# Altium schematic sheet PumpSystem.SchDoc
size A3; CompanyName: FEDEVEL; Organization: FEDEVEL; DocumentNumber: 3; Revision: V1I1; SheetNumber: 3; SheetTotal: 12; PageSetup: Record=PageOptions|CenterHorizontal=True|CenterVertical=True|PrintScale=1.07|XCorrection=1.00|YCorrection=1.00|PrintKind=1|BorderSize=5000000|LeftOffset=0|BottomOffset=0|Orientation=2|PaperLength=1000|PaperWidth=1000|Scale=100|PaperSource=7|PrintQuality=600|MediaType=1|DitherType=10|PaperKind=A3|PrintScaleMode=1; ProjectName: KDS C6A816x Module
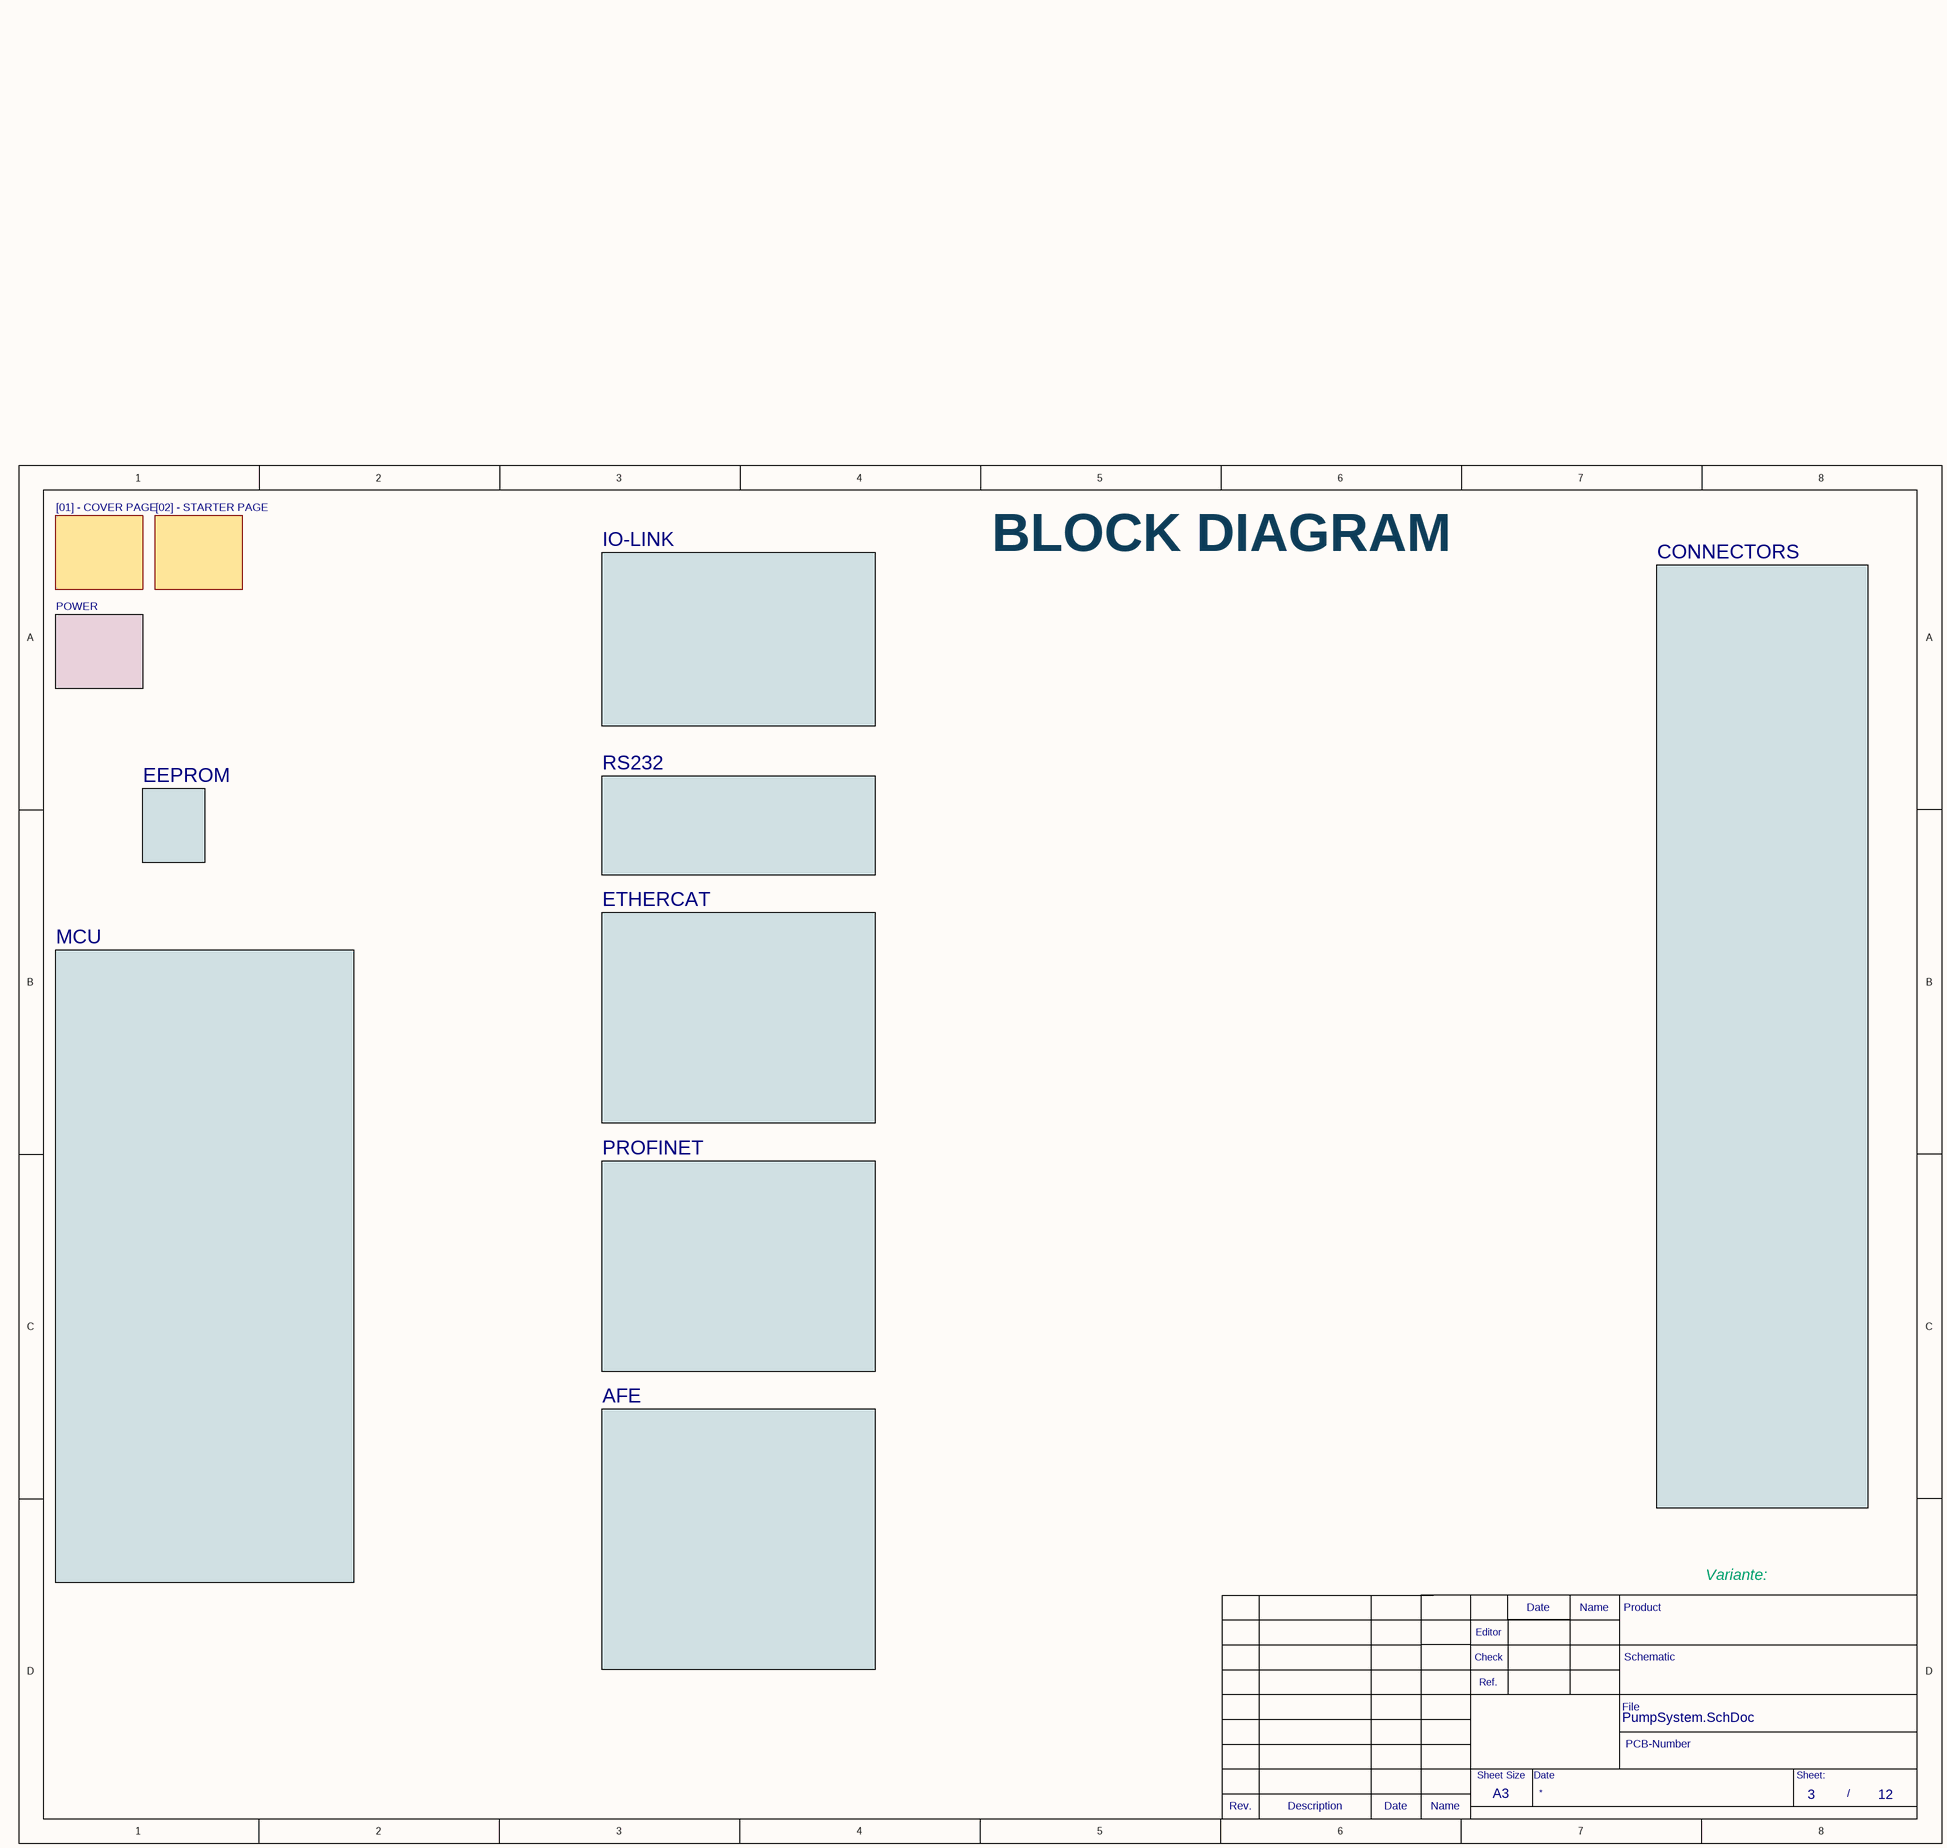
[diagram p0: PumpSystem.SchDoc]

## Sub-sheets
[01] - COVER PAGE = [01] - COVER PAGE.SchDoc: no entries
[02] - STARTER PAGE = [02] - STARTER PAGE.SchDoc: no entries
AFE = [09] - AFE.SchDoc: no entries
CONNECTORS = [10] - CONNECTORs.SchDoc: no entries
EEPROM = [11] - EEPROM.SchDoc: no entries
ETHERCAT = [04] - ETHERCAT.SchDoc: no entries
IO-LINK = [08] - IO-LINK.SchDoc: no entries
MCU = [03] - MCU.SchDoc: no entries
POWER = [06] - POWER.SchDoc: no entries
PROFINET = [05] - PROFINET.SchDoc: no entries
RS232 = [07] - RS232.SchDoc: no entries

## Notes on the sheet
- BLOCK DIAGRAM
- Date
- Name
- Product
- Variante:
- Editor
- Check
- Ref.
- Schematic
- File
- PCB-Number
- Rev.
- Description
- Sheet Size
- A3
- Sheet:
- /